# EasyEDA Pro project chisflash1.2震动卡.epro, schematic ChisFlash-Onix-1.2
Board Name: ChisFlash-Onix-圆角长金手指; Create Date: 2024-09-06; Page Name: P1; Project Name: ChisFlash; Schematic Name: ChisFlash-Onix-圆角长金手指; Update Date: 2024-09-18; Company: ChisBread/ChisFlash-Prometheus; Drawed: ChisBread; Page Size: A4; Reviewed: ChisBread; Version: 2
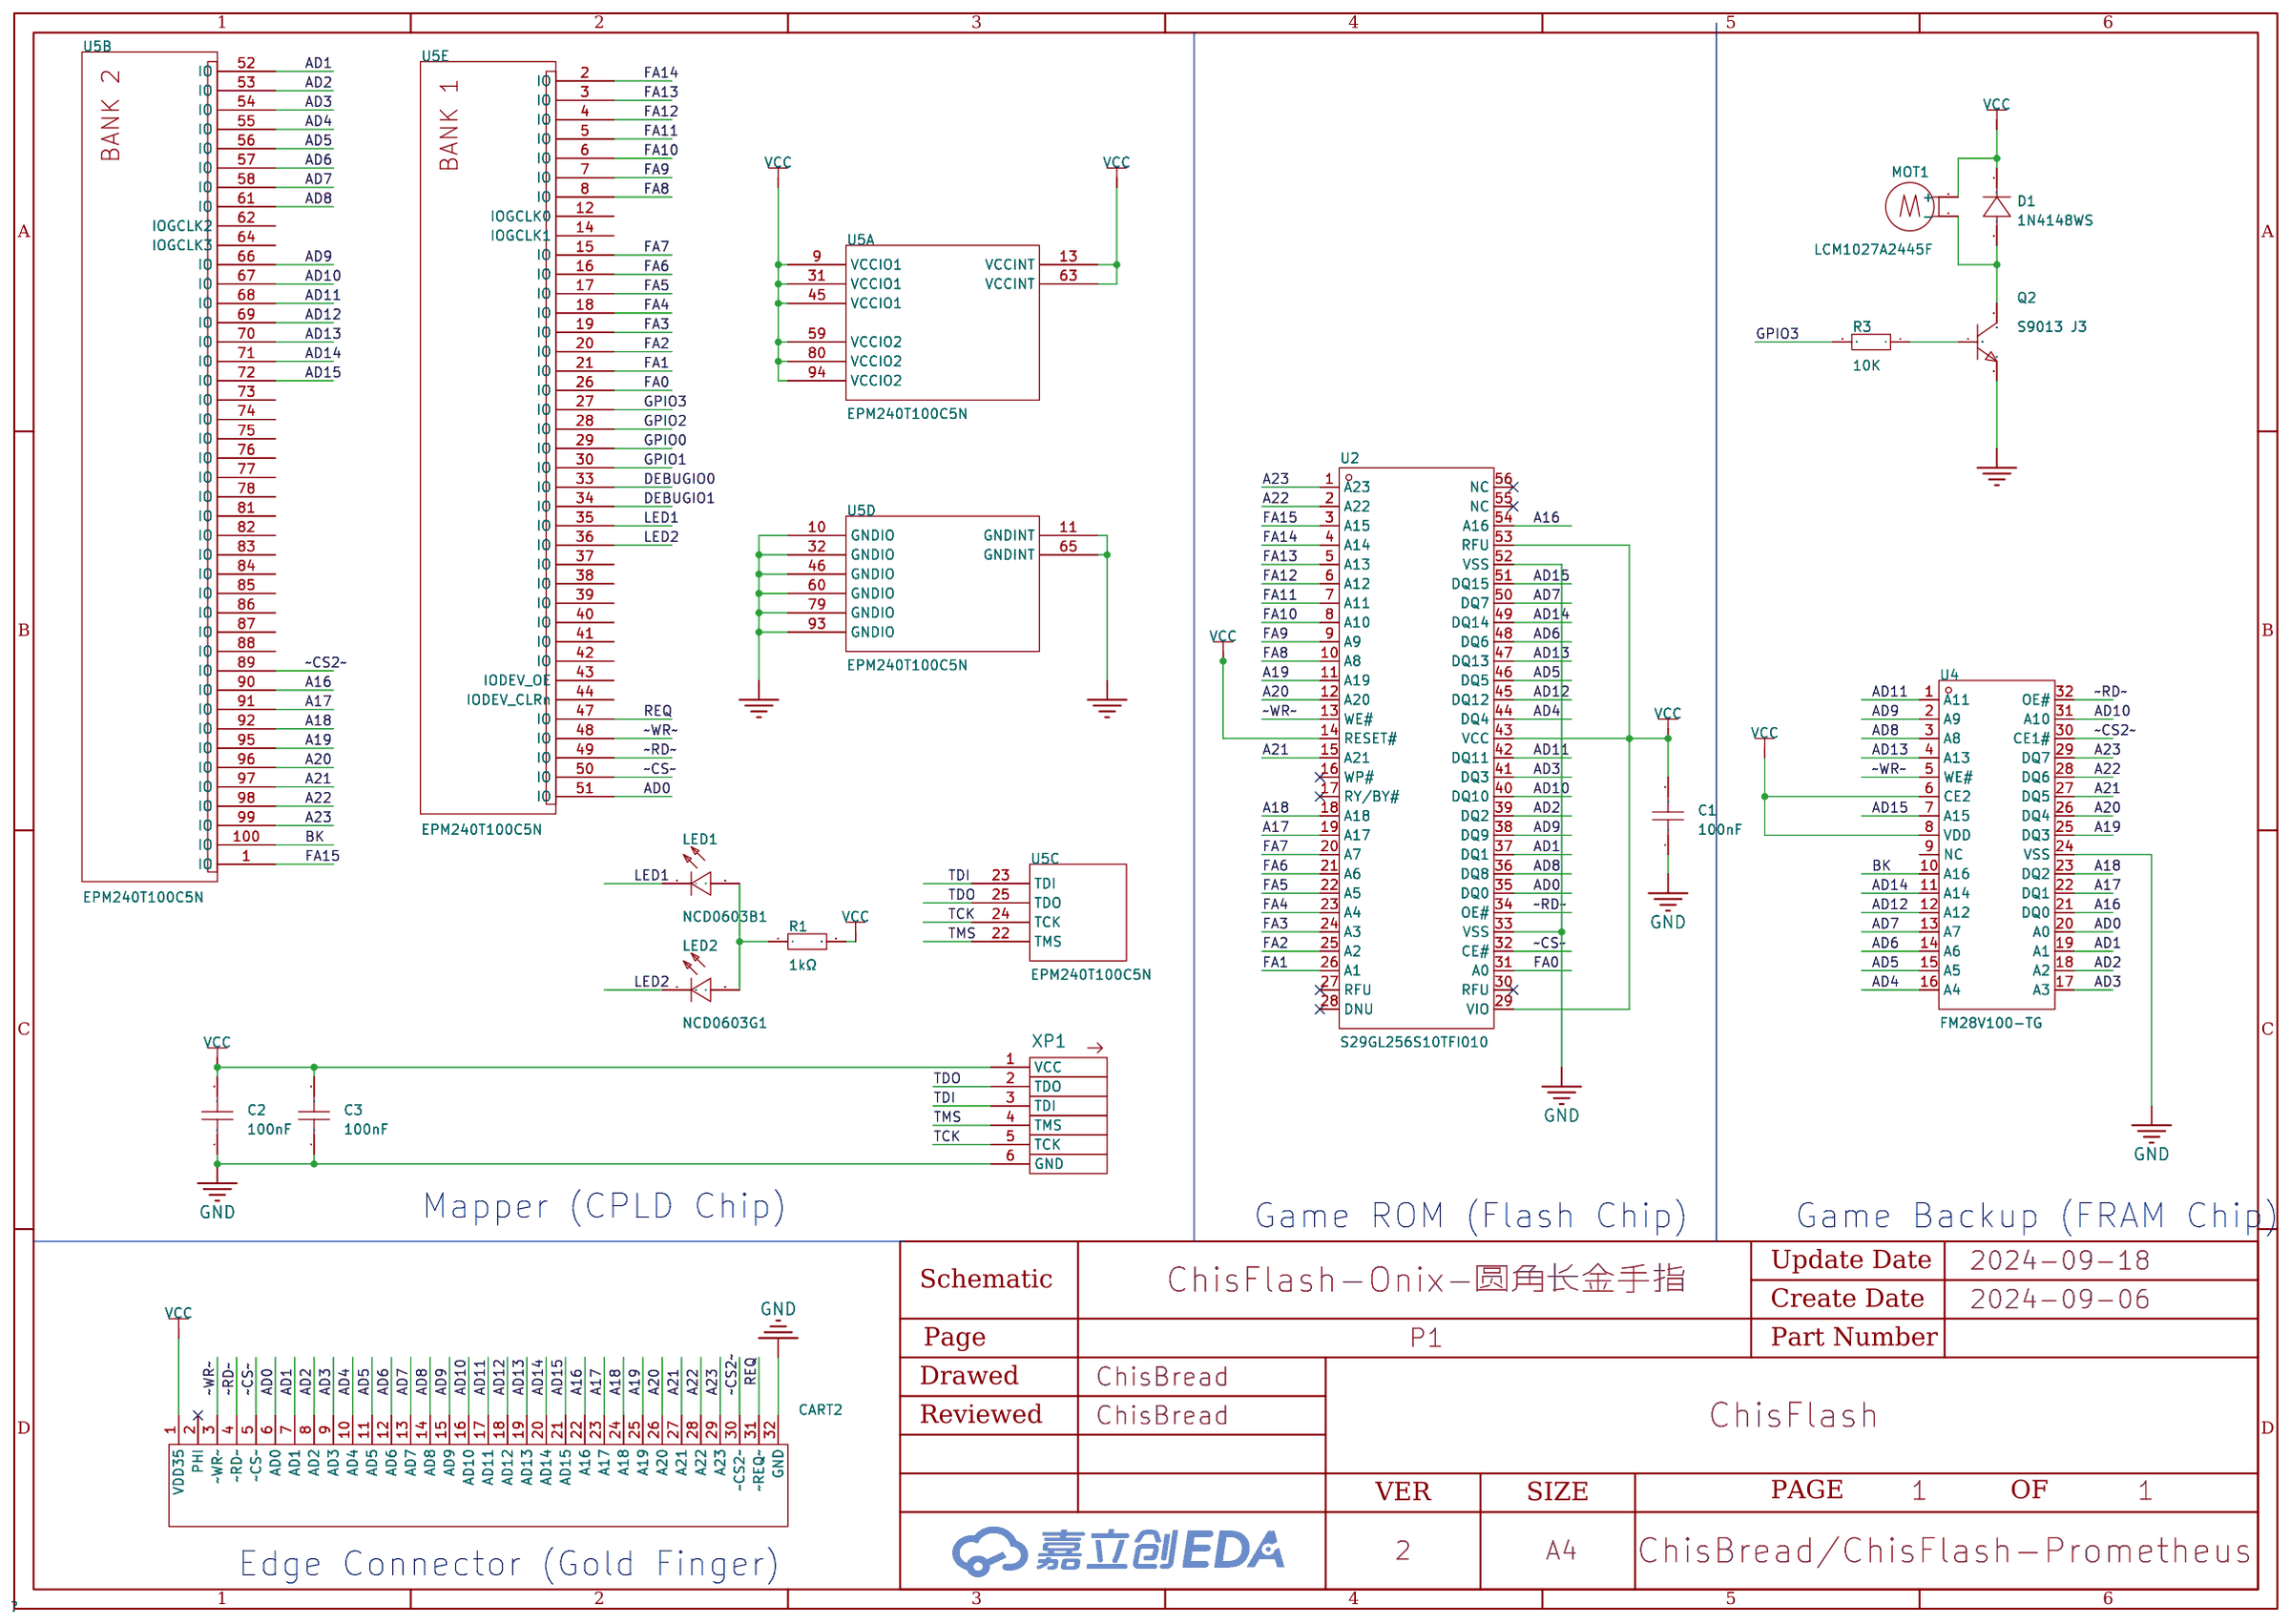
[diagram p0: schematic sheet]

## Parts
C1  100nF  [C0603]
C2  100nF  [C0603]
C3  100nF  [C0603]
CART2  -  [GBA卡带金手指]  (no BOM)
D1  1N4148WS  [SOD-323_L1.8-W1.3-LS2.5-RD]
LED1  NCD0603B1  [LED0603-RD]
LED2  NCD0603G1  [LED0603-RD]
MOT1  LCM1027A2445F  [VIBRATING-MOTOR-SMD_WELDING]
Q2  S9013 J3  [SOT-23-3_L2.9-W1.3-P1.90-LS2.4-BR]
R1  1kΩ  [R0603]
R3  10K  [R0603]
U2  S29GL256S10TFI010  [TSOP-56_L18.4-W14.0-P0.50-LS20.0-TL]
U4  FM28V100-TG  [STSOP-32_L8.0-W11.8-P0.50-LS13.4-TL]
U5  EPM240T100C5N  [TQFP-100_L14.0-W14.0-P0.50-LS16.0-BL]  (sections 1,2,3,4,5)
XP1  JTAG  [HDR-TH_6P-P1.27-V-M-1]  (no BOM)

## Library data of the parts
C1-C3 = CAP_0603: Supplier Footprint: 0603
CART2 = GBA卡带金手指
D1 = 1N4148WS_C917117: 二极管配置:独立式;正向压降(Vf):1.25V@150mA;直流反向耐压(Vr):100V;平均整流电流(Io):300mA;功率:400mW;反向恢复时间(trr):8ns;; LCSC Part Name: 电压:100V 电流:300mA; Supplier Part: C917117; Manufacturer: JSMSEMI(杰盛微); Supplier Footprint: SOD-323; JLCPCB Part Class: Extended Part; Datasheet: https://atta.szlcsc.com/upload/public/pdf/source/20230807/08D9F448A82EA88A23B325A669586A09.pdf; Supplier: LCSC; Diode Configuration: 独立式; Forward Voltage (Vf@If): 1.25V@150mA; Reverse Voltage (Vr): 100V; Average Rectified Current (Io): 300mA; Power Dissipation: 400mW; Reverse Leakage Current: 1uA@75V; Reverse Recovery Time (trr): 8ns; Operating Temperature: -55℃~+150℃@(Tj)
LED1 = NCD0603B1: 发光颜色:蓝色;正向电压(VF):2.6V~3.6V;功率:72mW;正向电流:10mA;主波长:463nm~475nm;透镜颜色:无色透明透镜;发光强度:80mcd~220mcd;发光角度:130°;工作温度:-30℃~+85℃;; Supplier Part: C84266; Manufacturer: 国星光电; Supplier Footprint: 0603; JLCPCB Part Class: 扩展库; Datasheet: https://atta.szlcsc.com/upload/public/pdf/source/20200820/C84266_6A3CDBEFA72C6CAD68EDA53474ADAE6C.pdf; Supplier: LCSC; Emitted Color: 蓝色; Forward Voltage (VF): 2.6V~3.6V; Power Dissipation: 72mW; Forward Current: 10mA; Dominant Wavelength: 463nm~475nm; Lens Color: 无色透明透镜; Luminous Intensity: 80mcd~220mcd; Viewing Angle: 130°; Operating Temperature: -30℃~+85℃
LED2 = NCD0603G1: 发光颜色:翠绿色;正向电压(VF):2.6V~3.6V;功率:72mW;正向电流:10mA;主波长:515nm~530nm;透镜颜色:无色透明透镜;发光强度:330mcd~900mcd;发光角度:130°;工作温度:-30℃~+85℃;; Supplier Part: C84267; Manufacturer: 国星光电; Supplier Footprint: 0603; JLCPCB Part Class: 扩展库; Datasheet: https://atta.szlcsc.com/upload/public/pdf/source/20200820/C84267_04BA7703640BAC111D09F5EFB971FBF3.pdf; Supplier: LCSC; Emitted Color: 翠绿色; Forward Voltage (VF): 2.6V~3.6V; Power Dissipation: 72mW; Forward Current: 10mA; Dominant Wavelength: 515nm~530nm; Lens Color: 无色透明透镜; Luminous Intensity: 330mcd~900mcd; Viewing Angle: 130°; Operating Temperature: -30℃~+85℃
MOT1 = LCM1027A2445F: 类型:扁平振动马达;额定电压:3V;额定转速:10000rpm;旋转方向:CW；CCW;; LCSC Part Name: 扁平1027 振动马达; Supplier Part: C2759984; Manufacturer: LEADER(立得); JLCPCB Part Class: 扩展库; Datasheet: https://atta.szlcsc.com/upload/public/pdf/source/20210326/C2759984_5008EC97BD438BDFB6866D31635439F4.pdf; Supplier: LCSC; Type: 扁平振动马达; Rated Voltage: 3V; Rated Current: 80mA; Rated Speed: 10000rpm; Operating Temperature: -20℃~+60℃; Sense Of Rotation: CW；CCW
Q2 = S9013 J3: 晶体管类型:NPN;集电极电流(Ic):500mA;集射极击穿电压(Vceo):25V;功率(Pd):300mW;直流电流增益(hFE@Ic,Vce):200@50mA,1V;; LCSC Part Name: S9013 J3(RANGE:200-350) H档(200-350); Supplier Part: C6749; Manufacturer: CJ(江苏长电/长晶); Supplier Footprint: SOT-23; JLCPCB Part Class: 基础库; Datasheet: https://atta.szlcsc.com/upload/public/pdf/source/20140809/1457707213610.pdf; Supplier: LCSC; Transistor Type: NPN; Collector Current (Ic): 500mA; Collector-Emitter Breakdown Voltage (Vceo): 25V; Power Dissipation (Pd): 300mW; DC Current Gain (hFE@Ic,Vce): 200@50mA,1V; Transition Frequency (fT): 150MHz; Collector Cut-Off Current (Icbo): 100nA; Collector-Emitter Saturation Voltage (VCE(sat)@Ic,Ib): 600mV@500mA,50mA
R1 = 0603WAF1001T5E: 电阻类型:厚膜电阻;阻值:1kΩ;精度:±1%;功率:100mW;最大工作电压:75V;温度系数:±100ppm/℃;; LCSC Part Name: 1kΩ ±1% 100mW 厚膜电阻; Supplier Part: C21190; Manufacturer: UNI-ROYAL(厚声); Supplier Footprint: 0603; JLCPCB Part Class: 基础库; Datasheet: https://atta.szlcsc.com/upload/public/pdf/source/20200306/C422600_1E6D84923E4A46A82E41ADD87F860B5C.pdf; Supplier: LCSC; Type: 厚膜电阻; Tolerance: ±1%; Power(Watts): 100mW; Overload Voltage (Max): 75V; Temperature Coefficient: ±100ppm/℃; Operating Temperature Range: -55℃~+155℃
R3 = Res_0603: Supplier Footprint: 0603
U2 = S29GL256S10TFI010: Supplier Part: C1350995; Manufacturer: SPANSION(飞索); Supplier Footprint: TSOP-56; JLCPCB Part Class: Extended Part; Datasheet: https://atta.szlcsc.com/upload/public/pdf/source/20201109/C914940_4A5E28132C9BE0EE19A790F58F84C86D.pdf; Supplier: LCSC
U4 = FM28V100-TG: Supplier Part: C2959453; Manufacturer: CYPRESS(赛普拉斯); Supplier Footprint: TFSOP-32; JLCPCB Part Class: 扩展库; Datasheet: https://atta.szlcsc.com/upload/public/pdf/source/20210608/2F2AEFEDCE558E0D37969C616959BD3C.pdf; Supplier: LCSC
U5 = EPM240T100C5N: 类型:其它PLD;逻辑门数量:-;逻辑单元数:-;逻辑阵列块数:240;; Supplier Part: C10041; Manufacturer: Intel/Altera; Supplier Footprint: TQFP-100(14x14); JLCPCB Part Class: 扩展库; Datasheet: https://atta.szlcsc.com/upload/public/pdf/source/20121123/1457706563537.pdf; Supplier: LCSC; Type: 其它PLD; Supply Voltage Range - VCCIO: 3.3V；2.5V; Logic Array Blocks: 240; Maximum Delay Time Tpd: 4.7ns; Operating Temperature Range: 0℃~+85℃
XP1 = jtag

## Nets
GND: C1.1 C2.1 C3.1 CART2.32(GND) Q2.2(E) U2.33(VSS) U2.52(VSS) U4.24(VSS) U5.10(GNDIO) U5.11(GNDINT) U5.32(GNDIO) U5.46(GNDIO) U5.60(GNDIO) U5.65(GNDINT) U5.79(GNDIO) U5.93(GNDIO) XP1.6(GND)
VCC: C1.2 C2.2 C3.2 CART2.1(VDD35) D1.1(C) MOT1.2(+) R1.2 U2.14(RESET#) U2.29(VIO) U2.43(VCC) U2.53(RFU) U4.6(CE2) U4.8(VDD) U5.9(VCCIO1) U5.13(VCCINT) U5.31(VCCIO1) U5.45(VCCIO1) U5.59(VCCIO2) U5.63(VCCINT) U5.80(VCCIO2) U5.94(VCCIO2) XP1.1(VCC)
A16: CART2.22(A16) U2.54(A16) U4.21(DQ0) U5.90(IO)
A17: CART2.23(A17) U2.19(A17) U4.22(DQ1) U5.91(IO)
A18: CART2.24(A18) U2.18(A18) U4.23(DQ2) U5.92(IO)
A19: CART2.25(A19) U2.11(A19) U4.25(DQ3) U5.95(IO)
A20: CART2.26(A20) U2.12(A20) U4.26(DQ4) U5.96(IO)
A21: CART2.27(A21) U2.15(A21) U4.27(DQ5) U5.97(IO)
A22: CART2.28(A22) U2.2(A22) U4.28(DQ6) U5.98(IO)
A23: CART2.29(A23) U2.1(A23) U4.29(DQ7) U5.99(IO)
AD0: CART2.6(AD0) U2.35(DQ0) U4.20(A0) U5.51(IO)
AD1: CART2.7(AD1) U2.37(DQ1) U4.19(A1) U5.52(IO)
AD2: CART2.8(AD2) U2.39(DQ2) U4.18(A2) U5.53(IO)
AD3: CART2.9(AD3) U2.41(DQ3) U4.17(A3) U5.54(IO)
AD4: CART2.10(AD4) U2.44(DQ4) U4.16(A4) U5.55(IO)
AD5: CART2.11(AD5) U2.46(DQ5) U4.15(A5) U5.56(IO)
AD6: CART2.12(AD6) U2.48(DQ6) U4.14(A6) U5.57(IO)
AD7: CART2.13(AD7) U2.50(DQ7) U4.13(A7) U5.58(IO)
AD8: CART2.14(AD8) U2.36(DQ8) U4.3(A8) U5.61(IO)
AD9: CART2.15(AD9) U2.38(DQ9) U4.2(A9) U5.66(IO)
AD10: CART2.16(AD10) U2.40(DQ10) U4.31(A10) U5.67(IO)
AD11: CART2.17(AD11) U2.42(DQ11) U4.1(A11) U5.68(IO)
AD12: CART2.18(AD12) U2.45(DQ12) U4.12(A12) U5.69(IO)
AD13: CART2.19(AD13) U2.47(DQ13) U4.4(A13) U5.70(IO)
AD14: CART2.20(AD14) U2.49(DQ14) U4.11(A14) U5.71(IO)
AD15: CART2.21(AD15) U2.51(DQ15) U4.7(A15) U5.72(IO)
BK: U4.10(A16) U5.100(IO)
DEBUGIO0: U5.33(IO)
DEBUGIO1: U5.34(IO)
FA0: U2.31(A0) U5.26(IO)
FA1: U2.26(A1) U5.21(IO)
FA2: U2.25(A2) U5.20(IO)
FA3: U2.24(A3) U5.19(IO)
FA4: U2.23(A4) U5.18(IO)
FA5: U2.22(A5) U5.17(IO)
FA6: U2.21(A6) U5.16(IO)
FA7: U2.20(A7) U5.15(IO)
FA8: U2.10(A8) U5.8(IO)
FA9: U2.9(A9) U5.7(IO)
FA10: U2.8(A10) U5.6(IO)
FA11: U2.7(A11) U5.5(IO)
FA12: U2.6(A12) U5.4(IO)
FA13: U2.5(A13) U5.3(IO)
FA14: U2.4(A14) U5.2(IO)
FA15: U2.3(A15) U5.1(IO)
GPIO0: U5.29(IO)
GPIO1: U5.30(IO)
GPIO2: U5.28(IO)
GPIO3: R3.2 U5.27(IO)
LED1: LED1.1(-) U5.35(IO)
LED2: LED2.1(K) U5.36(IO)
REQ: CART2.31(~REQ~) U5.47(IO)
TCK: U5.24(TCK) XP1.5(TCK)
TDI: U5.23(TDI) XP1.3(TDI)
TDO: U5.25(TDO) XP1.2(TDO)
TMS: U5.22(TMS) XP1.4(TMS)
~CS2~: CART2.30(~CS2~) U4.30(CE1#) U5.89(IO)
~CS~: CART2.5(~CS~) U2.32(CE#) U5.50(IO)
~RD~: CART2.4(~RD~) U2.34(OE#) U4.32(OE#) U5.49(IO)
~WR~: CART2.3(~WR~) U2.13(WE#) U4.5(WE#) U5.48(IO)
$1N88719: D1.2(A) MOT1.1(-) Q2.3(C)
$1N89891: Q2.1(B) R3.1
$1N92412: LED1.2(+) LED2.2(A) R1.1

Not connected (* = marked no-connect by the designer): CART2 2(PHI)*; U2 16(WP#)* 17(RY/BY#)* 27(RFU)* 28(DNU)* 30(RFU)* 55(NC)* 56(NC)*; U4 9(NC); U5 12(IOGCLK0) 14(IOGCLK1) 37(IO) 38(IO) 39(IO) 40(IO) 41(IO) 42(IO) 43(IODEV_OE) 44(IODEV_CLRn) 62(IOGCLK2) 64(IOGCLK3) 73(IO) 74(IO) 75(IO) 76(IO) 77(IO) 78(IO) 81(IO) 82(IO) 83(IO) 84(IO) 85(IO) 86(IO) 87(IO) 88(IO)

## Notes on the sheet
- Mapper (CPLD Chip)
- Game ROM (Flash Chip)
- Game Backup (FRAM Chip)
- Edge Connector (Gold Finger)
